# Altium schematic sheet Amplifier_Left.SchDoc
size A4
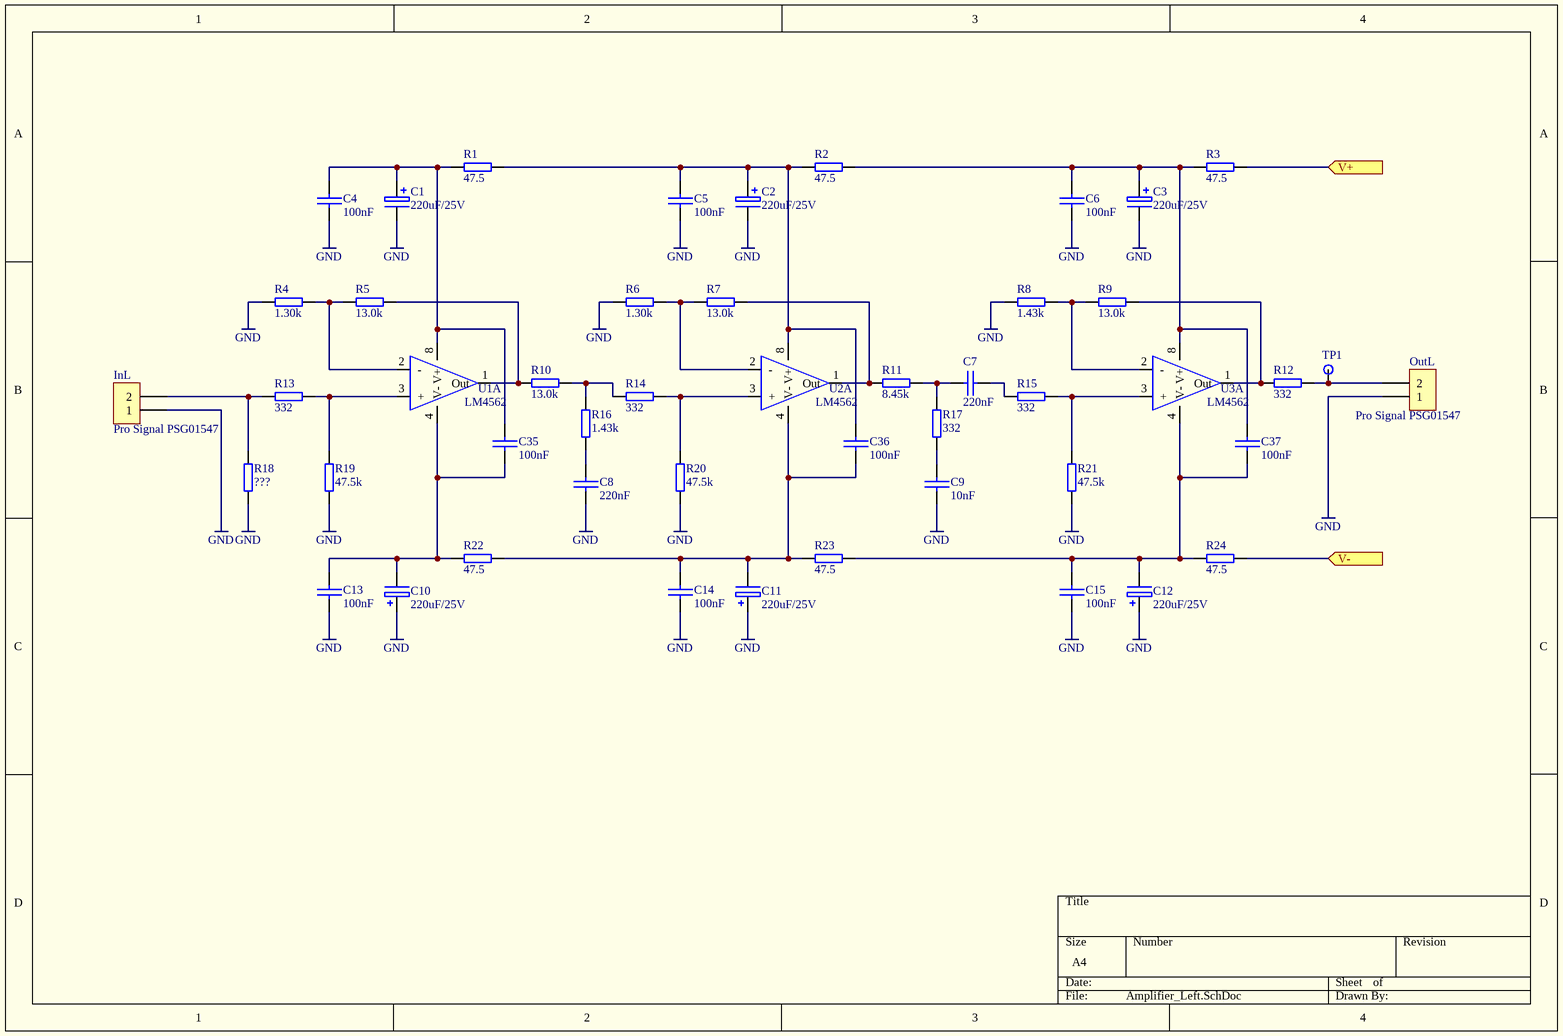
[diagram p0: Amplifier_Left.SchDoc]

## Parts
C1  220uF/25V  [CAP_EC8x16]
C2  220uF/25V  [CAP_EC8x16]
C3  220uF/25V  [CAP_EC8x16]
C4  100nF  [CAP_C200]
C5  100nF  [CAP_C200]
C6  100nF  [CAP_C200]
C7  220nF  [CAP_C200-1]
C8  220nF  [CAP_C200-1]
C9  10nF  [CAP_C200]
C10  220uF/25V  [CAP_EC8x16]
C11  220uF/25V  [CAP_EC8x16]
C12  220uF/25V  [CAP_EC8x16]
C13  100nF  [CAP_C200]
C14  100nF  [CAP_C200]
C15  100nF  [CAP_C200]
C35  100nF  [CAP_C200]
C36  100nF  [CAP_C200]
C37  100nF  [CAP_C200]
InL  Pro Signal PSG01547  [CON_RCA_PSG01547]
OutL  Pro Signal PSG01547  [CON_RCA_PSG01547]
R1  47.5  [RES_R400]
R2  47.5  [RES_R400]
R3  47.5  [RES_R400]
R4  1.30k  [RES_R400]
R5  13.0k  [RES_R400]
R6  1.30k  [RES_R400]
R7  13.0k  [RES_R400]
R8  1.43k  [RES_R400]
R9  13.0k  [RES_R400]
R10  13.0k  [RES_R400]
R11  8.45k  [RES_R400]
R12  332  [RES_R400]
R13  332  [RES_R400]
R14  332  [RES_R400]
R15  332  [RES_R400]
R16  1.43k  [RES_R400]
R17  332  [RES_R400]
R18  ???  [RES_R400]
R19  47.5k  [RES_R400]
R20  47.5k  [RES_R400]
R21  47.5k  [RES_R400]
R22  47.5  [RES_R400]
R23  47.5  [RES_R400]
R24  47.5  [RES_R400]
TP1  TESTPAD  [MISC_PAD-36/65]  (value not drawn)
U1  LM4562  [IC_DIP-8]  (part A of 2)
U2  LM4562  [IC_DIP-8]  (part A of 2)
U3  LM4562  [IC_DIP-8]  (part A of 2)

## Ports
V+ (in), V- (in)

## Nets
GND: C1.2 C2.2 C3.2 C4.2 C5.2 C6.2 C8.2 C9.2 C10.1 C11.1 C12.1 C13.2 C14.2 C15.2 InL.1 OutL.1 R4.2 R6.2 R8.2 R18.1 R19.2 R20.2 R21.2
V+: R3.1 ; port V+
V-: R24.1 ; port V-
NetC1_1: C1.1 C4.1 C35.1 R1.2 U1.8(V+)
NetC2_1: C2.1 C5.1 C36.1 R1.1 R2.2 U2.8(V+)
NetC3_1: C3.1 C6.1 C37.1 R2.1 R3.2 U3.8(V+)
NetC7_1: C7.1 R11.1 R17.1
NetC7_2: C7.2 R15.2
NetC8_1: C8.1 R16.2
NetC9_1: C9.1 R17.2
NetC10_2: C10.2 C13.1 C35.2 R22.2 U1.4(V-)
NetC11_2: C11.2 C14.1 C36.2 R22.1 R23.2 U2.4(V-)
NetC12_2: C12.2 C15.1 C37.2 R23.1 R24.2 U3.4(V-)
NetInL_2: InL.2 R13.2 R18.2
NetOutL_2: OutL.2 R12.1 TP1.1
NetR4_1: R4.1 R5.2 U1.2(-)
NetR5_1: R5.1 R10.2 U1.1(Out)
NetR6_1: R6.1 R7.2 U2.2(-)
NetR7_1: R7.1 R11.2 U2.1(Out)
NetR8_1: R8.1 R9.2 U3.2(-)
NetR9_1: R9.1 R12.2 U3.1(Out)
NetR10_1: R10.1 R14.2 R16.1
NetR13_1: R13.1 R19.1 U1.3(+)
NetR14_1: R14.1 R20.1 U2.3(+)
NetR15_1: R15.1 R21.1 U3.3(+)

## Library data of the parts
C1-C3 C10-C12 = ELECTRO1: Electrolytic Capacitor
C4-C9 C13-C15 C35-C37 = CAP: Capacitor
InL OutL = CON2: Connector
R1-R24 = RES: Resistor
U1-U3 = OPAMP_Dual: standard dual op-amp